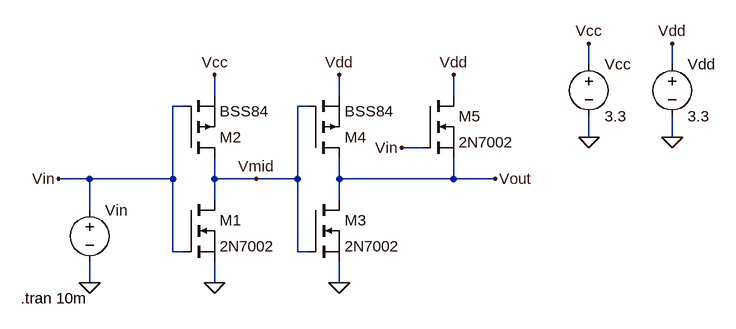
[diagram p0: schematic 4010.asc]
4010.asc, the LTspice schematic file:
Version 4
SHEET 1 944 680
WIRE 736 -64 736 -96
WIRE 864 -64 864 -96
WIRE 160 -16 160 -48
WIRE 352 -16 352 -48
WIRE 528 -16 528 -48
WIRE 112 0 96 0
WIRE 304 0 288 0
WIRE 736 48 736 16
WIRE 864 48 864 16
WIRE 480 64 448 64
WIRE -32 112 -80 112
WIRE 96 112 96 0
WIRE 96 112 -32 112
WIRE 160 112 160 80
WIRE 224 112 160 112
WIRE 288 112 288 0
WIRE 288 112 224 112
WIRE 352 112 352 80
WIRE 528 112 528 80
WIRE 528 112 352 112
WIRE 592 112 528 112
WIRE 160 144 160 112
WIRE 352 144 352 112
WIRE -32 160 -32 112
WIRE 96 224 96 112
WIRE 112 224 96 224
WIRE 288 224 288 112
WIRE 304 224 288 224
WIRE -32 272 -32 240
WIRE 160 272 160 240
WIRE 352 272 352 240
FLAG 160 272 0
FLAG 160 -48 Vcc
FLAG 352 272 0
FLAG 224 112 Vmid
FLAG -80 112 Vin
FLAG 592 112 Vout
FLAG 448 64 Vin
FLAG 528 -48 Vdd
FLAG 352 -48 Vdd
FLAG -32 272 0
FLAG 736 48 0
FLAG 864 48 0
FLAG 736 -96 Vcc
FLAG 864 -96 Vdd
SYMBOL nmos 112 144 R0
SYMATTR InstName M1
SYMATTR Value 2N7002
SYMBOL pmos 112 80 M180
SYMATTR InstName M2
SYMATTR Value BSS84
SYMBOL nmos 304 144 R0
SYMATTR InstName M3
SYMATTR Value 2N7002
SYMBOL pmos 304 80 M180
SYMATTR InstName M4
SYMATTR Value BSS84
SYMBOL nmos 480 -16 R0
SYMATTR InstName M5
SYMATTR Value 2N7002
SYMBOL voltage -32 144 R0
WINDOW 3 24 96 Invisible 2
WINDOW 123 0 0 Left 2
WINDOW 39 0 0 Left 2
SYMATTR InstName Vin
SYMATTR Value PULSE(0 3.3 0 1u 1u 1m 2m 100)
SYMBOL voltage 736 -80 R0
WINDOW 123 0 0 Left 2
WINDOW 39 0 0 Left 2
SYMATTR InstName Vcc
SYMATTR Value 3.3
SYMBOL voltage 864 -80 R0
WINDOW 123 0 0 Left 2
WINDOW 39 0 0 Left 2
SYMATTR InstName Vdd
SYMATTR Value 3.3
TEXT -138 296 Left 2 !.tran 10m

The netlist it stands for:
* 4010.asc
M1 Vmid Vin 0 0 2N7002
M2 Vmid Vin Vcc Vcc BSS84
M3 Vout Vmid 0 0 2N7002
M4 Vout Vmid Vdd Vdd BSS84
M5 Vdd Vin Vout Vout 2N7002
Vin Vin 0 PULSE(0 3.3 0 1u 1u 1m 2m 100)
Vcc Vcc 0 3.3
Vdd Vdd 0 3.3
.model NMOS NMOS
.model PMOS PMOS
.lib standard.mos
.tran 10m
.backanno
.end

* Results of the author's LTspice run, read from the files saved beside the schematic
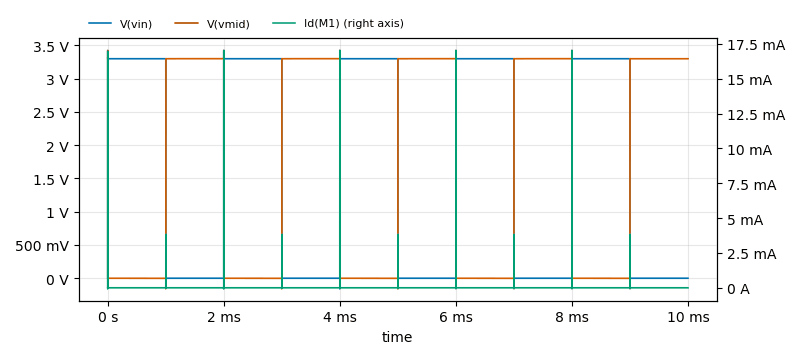
[diagram p1: Transient Analysis of 4010.asc, plotted from the saved traces]
* Transient Analysis, 1 run:
*   V(vin): min 0 V, max 3.3 V, average 1.652 V, rms 2.334 V, last 0 V
*   V(vmid): min -159 mV, max 3.426 V, average 1.648 V, rms 2.332 V, last 3.3 V
*   Id(M1): min -72.39 µA, max 17.03 mA, average 578.9 nA, rms 66.11 µA, last 0 A